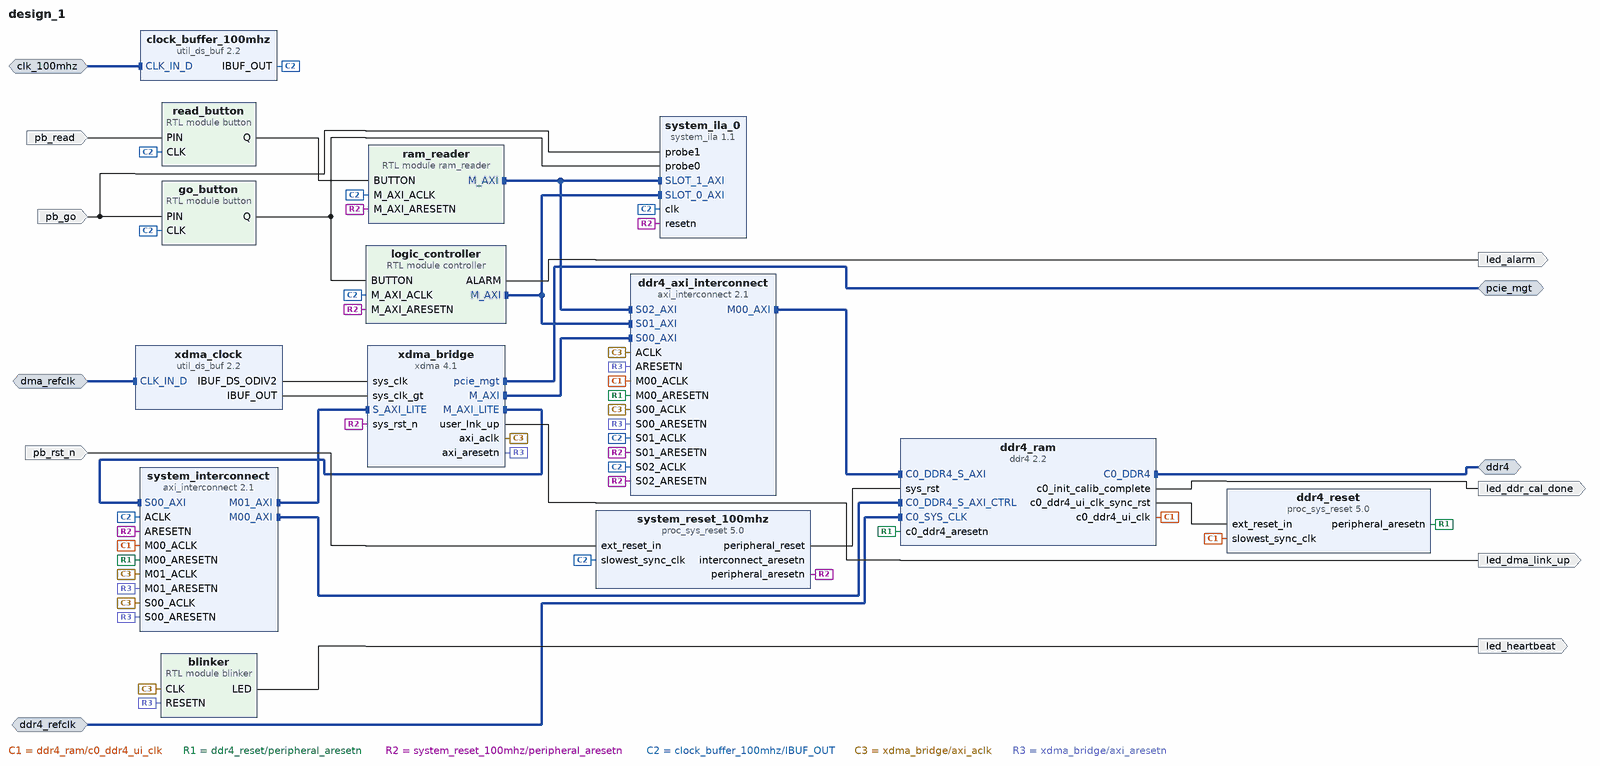
[diagram p0: block diagram of the top level]
# Vivado block design design_1, xczu19eg-ffvc1760-2-i, Vivado 2021.1
create_bd_design design_1

create_bd_intf_port -mode Master -vlnv xilinx.com:interface:ddr4_rtl:1.0 ddr4
create_bd_intf_port -mode Slave -vlnv xilinx.com:interface:diff_clock_rtl:1.0 ddr4_refclk
set_property -dict {CONFIG.FREQ_HZ 333000000} [get_bd_intf_ports ddr4_refclk]
create_bd_intf_port -mode Slave -vlnv xilinx.com:interface:diff_clock_rtl:1.0 clk_100mhz
create_bd_intf_port -mode Slave -vlnv xilinx.com:interface:diff_clock_rtl:1.0 dma_refclk
create_bd_intf_port -mode Master -vlnv xilinx.com:interface:pcie_7x_mgt_rtl:1.0 pcie_mgt
create_bd_port -dir I -type rst pb_rst_n
create_bd_port -dir I pb_go
create_bd_port -dir O led_heartbeat
create_bd_port -dir O led_alarm
create_bd_port -dir O led_ddr_cal_done
create_bd_port -dir O led_dma_link_up
create_bd_port -dir I pb_read

create_bd_cell -type ip -vlnv xilinx.com:ip:ddr4:2.2 ddr4_ram
set_property -dict [list \
  CONFIG.C0.CKE_WIDTH 2 \
  CONFIG.C0.CK_WIDTH 2 \
  CONFIG.C0.CS_WIDTH 2 \
  CONFIG.C0.DDR4_AxiAddressWidth 34 \
  CONFIG.C0.DDR4_AxiDataWidth 512 \
  CONFIG.C0.DDR4_CasLatency 17 \
  CONFIG.C0.DDR4_CasWriteLatency 16 \
  CONFIG.C0.DDR4_CustomParts ../../../../../../ddr4/custom_parts_KSM24SED8.csv \
  CONFIG.C0.DDR4_DataMask NO_DM_NO_DBI \
  CONFIG.C0.DDR4_DataWidth 72 \
  CONFIG.C0.DDR4_InputClockPeriod 3001 \
  CONFIG.C0.DDR4_MemoryPart DDR4_CUSTOM \
  CONFIG.C0.DDR4_MemoryType SODIMMs \
  CONFIG.C0.DDR4_TimePeriod 938 \
  CONFIG.C0.DDR4_isCustom true \
  CONFIG.C0.ODT_WIDTH 2 \
] [get_bd_cells ddr4_ram]
create_bd_cell -type ip -vlnv xilinx.com:ip:proc_sys_reset:5.0 ddr4_reset
create_bd_cell -type ip -vlnv xilinx.com:ip:axi_interconnect:2.1 ddr4_axi_interconnect
set_property -dict {CONFIG.NUM_MI 1 CONFIG.NUM_SI 3} [get_bd_cells ddr4_axi_interconnect]
create_bd_cell -type ip -vlnv xilinx.com:ip:proc_sys_reset:5.0 system_reset_100mhz
create_bd_cell -type ip -vlnv xilinx.com:ip:util_ds_buf:2.2 clock_buffer_100mhz
create_bd_cell -type ip -vlnv xilinx.com:ip:axi_interconnect:2.1 system_interconnect
set_property -dict {CONFIG.NUM_MI 2 CONFIG.NUM_SI 1} [get_bd_cells system_interconnect]
create_bd_cell -type ip -vlnv xilinx.com:ip:system_ila:1.1 system_ila_0
set_property -dict [list \
  CONFIG.C_MON_TYPE MIX \
  CONFIG.C_NUM_MONITOR_SLOTS 2 \
  CONFIG.C_NUM_OF_PROBES 2 \
  CONFIG.C_PROBE0_TYPE 0 \
  CONFIG.C_PROBE1_TYPE 0 \
  CONFIG.C_PROBE2_TYPE 0 \
  CONFIG.C_SLOT_0_APC_EN 0 \
  CONFIG.C_SLOT_0_AXI_AR_SEL_DATA 1 \
  CONFIG.C_SLOT_0_AXI_AR_SEL_TRIG 1 \
  CONFIG.C_SLOT_0_AXI_AW_SEL_DATA 1 \
  CONFIG.C_SLOT_0_AXI_AW_SEL_TRIG 1 \
  CONFIG.C_SLOT_0_AXI_B_SEL_DATA 1 \
  CONFIG.C_SLOT_0_AXI_B_SEL_TRIG 1 \
  CONFIG.C_SLOT_0_AXI_R_SEL_DATA 1 \
  CONFIG.C_SLOT_0_AXI_R_SEL_TRIG 1 \
  CONFIG.C_SLOT_0_AXI_W_SEL_DATA 1 \
  CONFIG.C_SLOT_0_AXI_W_SEL_TRIG 1 \
  CONFIG.C_SLOT_0_INTF_TYPE xilinx.com:interface:aximm_rtl:1.0 \
  CONFIG.C_SLOT_1_APC_EN 0 \
  CONFIG.C_SLOT_1_AXI_AR_SEL_DATA 1 \
  CONFIG.C_SLOT_1_AXI_AR_SEL_TRIG 1 \
  CONFIG.C_SLOT_1_AXI_AW_SEL_DATA 1 \
  CONFIG.C_SLOT_1_AXI_AW_SEL_TRIG 1 \
  CONFIG.C_SLOT_1_AXI_B_SEL_DATA 1 \
  CONFIG.C_SLOT_1_AXI_B_SEL_TRIG 1 \
  CONFIG.C_SLOT_1_AXI_R_SEL_DATA 1 \
  CONFIG.C_SLOT_1_AXI_R_SEL_TRIG 1 \
  CONFIG.C_SLOT_1_AXI_W_SEL_DATA 1 \
  CONFIG.C_SLOT_1_AXI_W_SEL_TRIG 1 \
  CONFIG.C_SLOT_1_INTF_TYPE xilinx.com:interface:aximm_rtl:1.0 \
] [get_bd_cells system_ila_0]
create_bd_cell -type module -reference button go_button
create_bd_cell -type ip -vlnv xilinx.com:ip:util_ds_buf:2.2 xdma_clock
set_property -dict {CONFIG.C_BUF_TYPE IBUFDSGTE} [get_bd_cells xdma_clock]
create_bd_cell -type ip -vlnv xilinx.com:ip:xdma:4.1 xdma_bridge
set_property -dict [list \
  CONFIG.PF0_DEVICE_ID_mqdma 903F \
  CONFIG.PF0_SRIOV_VF_DEVICE_ID A03F \
  CONFIG.PF2_DEVICE_ID_mqdma 923F \
  CONFIG.PF3_DEVICE_ID_mqdma 933F \
  CONFIG.axi_data_width 512_bit \
  CONFIG.axilite_master_en true \
  CONFIG.axilite_master_size 8 \
  CONFIG.axisten_freq 250 \
  CONFIG.cfg_mgmt_if false \
  CONFIG.enable_jtag_dbg true \
  CONFIG.mode_selection Advanced \
  CONFIG.pcie_blk_locn X1Y0 \
  CONFIG.pcie_extended_tag false \
  CONFIG.pciebar2axibar_axil_master 0A0000000 \
  CONFIG.pf0_Use_Class_Code_Lookup_Assistant false \
  CONFIG.pf0_base_class_menu Processing_accelerators \
  CONFIG.pf0_class_code_base 12 \
  CONFIG.pf0_class_code_interface 00 \
  CONFIG.pf0_device_id 903F \
  CONFIG.pf0_msi_enabled false \
  CONFIG.pf0_sub_class_interface_menu Unknown \
  CONFIG.pf0_subsystem_id 0007 \
  CONFIG.pl_link_cap_max_link_speed 8.0_GT/s \
  CONFIG.pl_link_cap_max_link_width X16 \
  CONFIG.plltype QPLL1 \
  CONFIG.xdma_axilite_slave true \
  CONFIG.xdma_sts_ports false \
  CONFIG.xdma_wnum_rids 32 \
] [get_bd_cells xdma_bridge]
create_bd_cell -type module -reference controller logic_controller
create_bd_cell -type module -reference blinker blinker
create_bd_cell -type module -reference button read_button
create_bd_cell -type module -reference ram_reader ram_reader

# ---- connections ----

connect_bd_intf_net -intf_net C0_SYS_CLK_0_1 [get_bd_intf_ports ddr4_refclk] [get_bd_intf_pins ddr4_ram/C0_SYS_CLK]
connect_bd_intf_net -intf_net CLK_IN_D_0_1 [get_bd_intf_ports clk_100mhz] [get_bd_intf_pins clock_buffer_100mhz/CLK_IN_D]
connect_bd_intf_net -intf_net CLK_IN_D_0_2 [get_bd_intf_ports dma_refclk] [get_bd_intf_pins xdma_clock/CLK_IN_D]
connect_bd_intf_net -intf_net controller_0_M_AXI [get_bd_intf_pins logic_controller/M_AXI] [get_bd_intf_pins ddr4_axi_interconnect/S01_AXI]
connect_bd_intf_net [get_bd_intf_pins logic_controller/M_AXI] [get_bd_intf_pins system_ila_0/SLOT_0_AXI]
connect_bd_intf_net -intf_net ddr4_0_C0_DDR4 [get_bd_intf_ports ddr4] [get_bd_intf_pins ddr4_ram/C0_DDR4]
connect_bd_intf_net [get_bd_intf_pins ddr4_axi_interconnect/M00_AXI] [get_bd_intf_pins ddr4_ram/C0_DDR4_S_AXI]
connect_bd_intf_net -intf_net ram_reader_0_M_AXI [get_bd_intf_pins ram_reader/M_AXI] [get_bd_intf_pins ddr4_axi_interconnect/S02_AXI]
connect_bd_intf_net [get_bd_intf_pins ram_reader/M_AXI] [get_bd_intf_pins system_ila_0/SLOT_1_AXI]
connect_bd_intf_net [get_bd_intf_pins ddr4_ram/C0_DDR4_S_AXI_CTRL] [get_bd_intf_pins system_interconnect/M00_AXI]
connect_bd_intf_net [get_bd_intf_pins system_interconnect/M01_AXI] [get_bd_intf_pins xdma_bridge/S_AXI_LITE]
connect_bd_intf_net -intf_net xdma_0_M_AXI [get_bd_intf_pins xdma_bridge/M_AXI] [get_bd_intf_pins ddr4_axi_interconnect/S00_AXI]
connect_bd_intf_net -intf_net xdma_0_M_AXI_LITE [get_bd_intf_pins xdma_bridge/M_AXI_LITE] [get_bd_intf_pins system_interconnect/S00_AXI]
connect_bd_intf_net [get_bd_intf_ports pcie_mgt] [get_bd_intf_pins xdma_bridge/pcie_mgt]
connect_bd_net -net PIN_0_1 [get_bd_ports pb_go] [get_bd_pins go_button/PIN] [get_bd_pins system_ila_0/probe1]
connect_bd_net -net PIN_0_2 [get_bd_ports pb_read] [get_bd_pins read_button/PIN]
connect_bd_net -net blinker_0_LED [get_bd_pins blinker/LED] [get_bd_ports led_heartbeat]
connect_bd_net -net button_0_Q [get_bd_pins go_button/Q] [get_bd_pins system_ila_0/probe0] [get_bd_pins logic_controller/BUTTON]
connect_bd_net -net button_0_Q1 [get_bd_pins read_button/Q] [get_bd_pins ram_reader/BUTTON]
connect_bd_net [get_bd_pins ddr4_ram/c0_ddr4_ui_clk] \
  [get_bd_pins ddr4_reset/slowest_sync_clk] [get_bd_pins ddr4_axi_interconnect/M00_ACLK] \
  [get_bd_pins system_interconnect/M00_ACLK]
connect_bd_net [get_bd_pins ddr4_ram/c0_ddr4_ui_clk_sync_rst] [get_bd_pins ddr4_reset/ext_reset_in]
connect_bd_net [get_bd_pins ddr4_ram/c0_init_calib_complete] [get_bd_ports led_ddr_cal_done]
connect_bd_net [get_bd_pins ddr4_reset/peripheral_aresetn] \
  [get_bd_pins ddr4_ram/c0_ddr4_aresetn] [get_bd_pins ddr4_axi_interconnect/M00_ARESETN] \
  [get_bd_pins system_interconnect/M00_ARESETN]
connect_bd_net -net ext_reset_in_0_1 [get_bd_ports pb_rst_n] [get_bd_pins system_reset_100mhz/ext_reset_in]
connect_bd_net [get_bd_pins logic_controller/ALARM] [get_bd_ports led_alarm]
# net system_reset_100mhz_interconnect_aresetn has one end: system_reset_100mhz/interconnect_aresetn
connect_bd_net [get_bd_pins system_reset_100mhz/peripheral_aresetn] \
  [get_bd_pins system_interconnect/ARESETN] [get_bd_pins system_ila_0/resetn] [get_bd_pins xdma_bridge/sys_rst_n] \
  [get_bd_pins ddr4_axi_interconnect/S01_ARESETN] [get_bd_pins logic_controller/M_AXI_ARESETN] \
  [get_bd_pins ddr4_axi_interconnect/S02_ARESETN] [get_bd_pins ram_reader/M_AXI_ARESETN]
connect_bd_net [get_bd_pins system_reset_100mhz/peripheral_reset] [get_bd_pins ddr4_ram/sys_rst]
connect_bd_net -net util_ds_buf_0_IBUF_OUT [get_bd_pins clock_buffer_100mhz/IBUF_OUT] \
  [get_bd_pins system_reset_100mhz/slowest_sync_clk] [get_bd_pins system_interconnect/ACLK] [get_bd_pins system_ila_0/clk] \
  [get_bd_pins go_button/CLK] [get_bd_pins ddr4_axi_interconnect/S01_ACLK] [get_bd_pins logic_controller/M_AXI_ACLK] \
  [get_bd_pins read_button/CLK] [get_bd_pins ddr4_axi_interconnect/S02_ACLK] [get_bd_pins ram_reader/M_AXI_ACLK]
connect_bd_net -net xdma_0_axi_aclk [get_bd_pins xdma_bridge/axi_aclk] \
  [get_bd_pins ddr4_axi_interconnect/S00_ACLK] [get_bd_pins system_interconnect/M01_ACLK] \
  [get_bd_pins system_interconnect/S00_ACLK] [get_bd_pins ddr4_axi_interconnect/ACLK] [get_bd_pins blinker/CLK]
connect_bd_net -net xdma_0_axi_aresetn [get_bd_pins xdma_bridge/axi_aresetn] \
  [get_bd_pins ddr4_axi_interconnect/S00_ARESETN] [get_bd_pins system_interconnect/M01_ARESETN] \
  [get_bd_pins system_interconnect/S00_ARESETN] [get_bd_pins ddr4_axi_interconnect/ARESETN] [get_bd_pins blinker/RESETN]
connect_bd_net [get_bd_pins xdma_bridge/user_lnk_up] [get_bd_ports led_dma_link_up]
connect_bd_net [get_bd_pins xdma_clock/IBUF_DS_ODIV2] [get_bd_pins xdma_bridge/sys_clk]
connect_bd_net [get_bd_pins xdma_clock/IBUF_OUT] [get_bd_pins xdma_bridge/sys_clk_gt]
set_property HDL_ATTRIBUTE.DEBUG true [get_bd_intf_nets controller_0_M_AXI]
set_property HDL_ATTRIBUTE.MARK_DEBUG true [get_bd_intf_nets controller_0_M_AXI]
set_property HDL_ATTRIBUTE.DEBUG true [get_bd_intf_nets ram_reader_0_M_AXI]
set_property HDL_ATTRIBUTE.MARK_DEBUG true [get_bd_intf_nets ram_reader_0_M_AXI]
set_property HDL_ATTRIBUTE.DEBUG true [get_bd_nets PIN_0_1]
set_property HDL_ATTRIBUTE.MARK_DEBUG true [get_bd_nets PIN_0_1]
set_property HDL_ATTRIBUTE.DEBUG true [get_bd_nets button_0_Q]
set_property HDL_ATTRIBUTE.MARK_DEBUG true [get_bd_nets button_0_Q]

# ---- address map ----
assign_bd_address -offset 0x000000000 -range 16G -target_address_space [get_bd_addr_spaces logic_controller/M_AXI] [get_bd_addr_segs ddr4_ram/C0_DDR4_MEMORY_MAP/C0_DDR4_ADDRESS_BLOCK]
assign_bd_address -offset 0x000000000 -range 16G -target_address_space [get_bd_addr_spaces ram_reader/M_AXI] [get_bd_addr_segs ddr4_ram/C0_DDR4_MEMORY_MAP/C0_DDR4_ADDRESS_BLOCK]
assign_bd_address -offset 0x0000000000000000 -range 16G -target_address_space [get_bd_addr_spaces xdma_bridge/M_AXI] [get_bd_addr_segs ddr4_ram/C0_DDR4_MEMORY_MAP/C0_DDR4_ADDRESS_BLOCK]
assign_bd_address -offset 0xA0010000 -range 64K -target_address_space [get_bd_addr_spaces xdma_bridge/M_AXI_LITE] [get_bd_addr_segs xdma_bridge/S_AXI_LITE/CTL0]
assign_bd_address -offset 0xA0020000 -range 64K -target_address_space [get_bd_addr_spaces xdma_bridge/M_AXI_LITE] [get_bd_addr_segs ddr4_ram/C0_DDR4_MEMORY_MAP_CTRL/C0_REG]

validate_bd_design
save_bd_design
